# EAGLE design laminator (EAGLE 7.3.0)
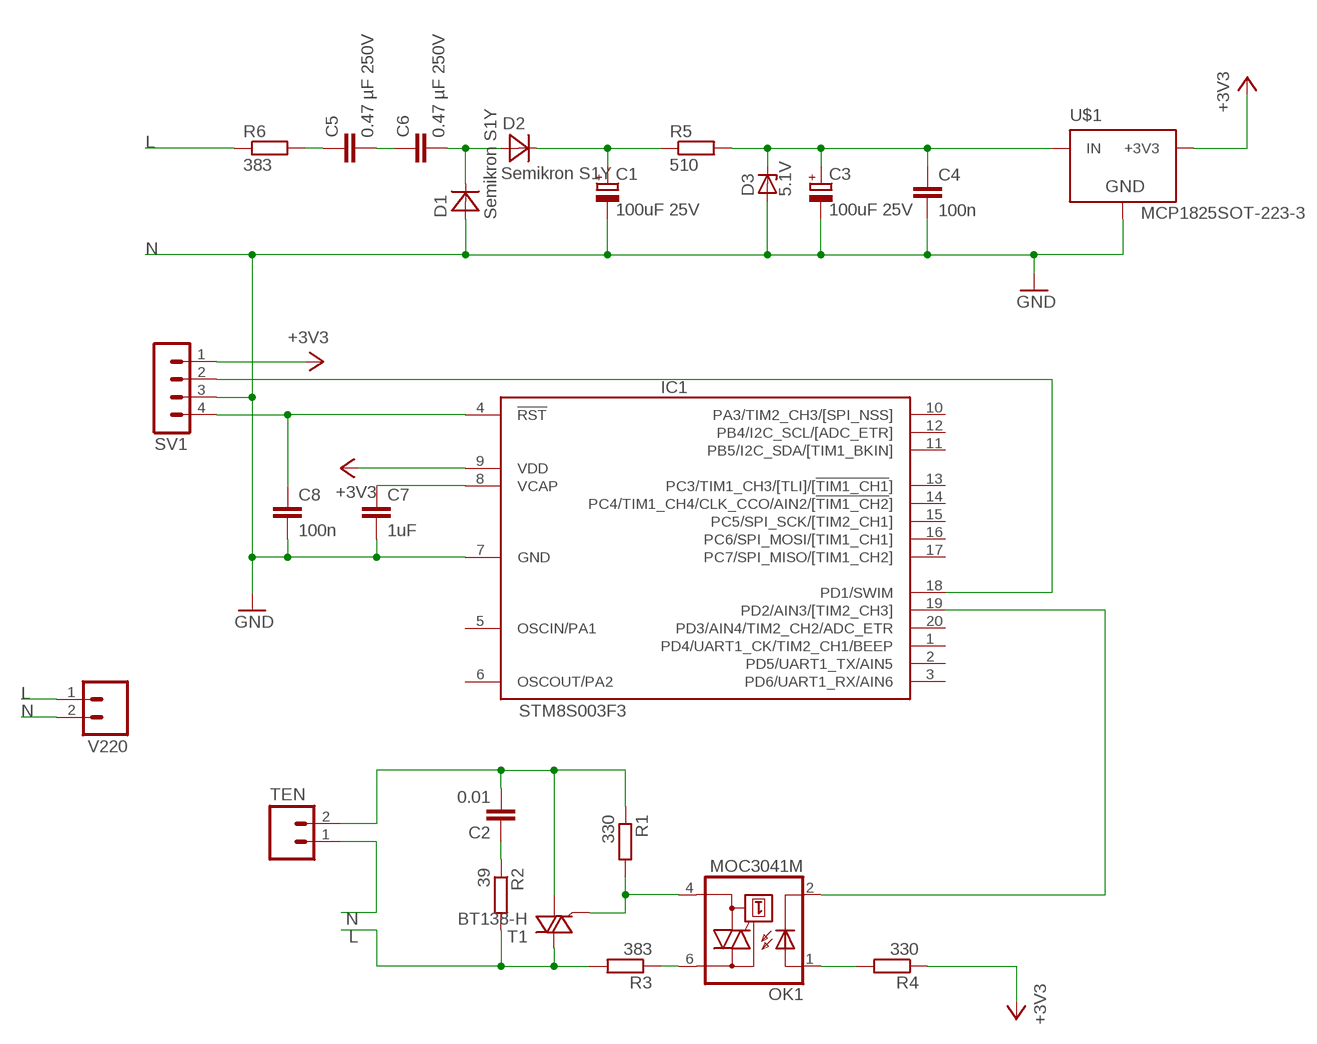
[diagram p0: schematic, sheet 1]

## Parts
C1  100uF 25V  CPOL-EUE2.5-6  [E2,5-6]
C2  0.01  C-EU050-025X075  [C050-025X075]
C3  100uF 25V  CPOL-EUE2.5-6  [E2,5-6]
C4  100n  C-EUC0805  [C0805]
C5  0.47 µF 250V  C-EU150-072X183  [C150-072X183]
C6  0.47 µF 250V  C-EU150-072X183  [C150-072X183]
C7  1uF  C-EUC0805  [C0805]
C8  100n  C-EUC0805  [C0805]
D1  Semikron S1Y  MBRA340T3  [SMA]
D2  Semikron S1Y  MBRA340T3  [SMA]
D3  5.1V  ZENER-DIODESMB  [SMB]
IC1  STM8S003F3  [TSSOP20]
OK1  MOC3041M  [DIL06]
R1  330  R-EU_0207/7  [0207/7]
R2  39  R-EU_0207/7  [0207/7]
R3  383  R-EU_0207/7  [0207/7]
R4  330  R-EU_R1206  [R1206]
R5  510  R-EU_R0805  [R0805]
R6  383  R-EU_0207/7  [0207/7]
SV1  MA04-1  [MA04-1]
T1  BT138-H  [TO220BH]
TEN  M02  [02P]
U$1  MCP1825SOT-223-3  [SOT-223]
V220  M02  [02P]

## Nets
+3V3: IC1.9(VDD) R4.1 SV1.1 U$1.3(+3V3)
L: R2.2 R3.2 R6.1 T1.T2(A2) V220.1
N: C1.- C3.- C4.2 C7.2 C8.2 D1.A D3.A IC1.7(GND) SV1.3 TEN.1 U$1.2(GND) V220.2 ; supply symbol labelled GND
N$1: OK1.6(A2) R3.1
N$2: C7.1 IC1.8(VCAP)
N$3: OK1.4(A1) R1.2 T1.G
N$4: C2.2 R1.1 T1.T1(A1) TEN.2
N$5: C6.2 D1.C D2.A
N$6: C2.1 R2.1
N$7: C8.1 IC1.4(!RST) SV1.4
N$8: OK1.1(A) R4.2
N$9: IC1.18(PD1/SWIM) SV1.2
N$10: IC1.19(PD2/AIN3/[TIM2_CH3]) OK1.2(C)
N$11: C1.+ D2.C R5.1
N$12: C3.+ C4.1 D3.C R5.2 U$1.1(IN)
N$14: C5.1 R6.2
N$15: C5.2 C6.1
Unconnected: IC1.1(PD4/UART1_CK/TIM2_CH1/BEEP) IC1.2(PD5/UART1_TX/AIN5) IC1.3(PD6/UART1_RX/AIN6) IC1.5(OSCIN/PA1) IC1.6(OSCOUT/PA2) IC1.10(PA3/TIM2_CH3/[SPI_NSS]) IC1.11(PB5/I2C_SDA/[TIM1_BKIN]) IC1.12(PB4/I2C_SCL/[ADC_ETR]) IC1.13(PC3/TIM1_CH3/[TLI]/[!TIM1_CH1!]) IC1.14(PC4/TIM1_CH4/CLK_CCO/AIN2/[!TIM1_CH2!]) IC1.15(PC5/SPI_SCK/[TIM2_CH1]) IC1.16(PC6/SPI_MOSI/[TIM1_CH1]) IC1.17(PC7/SPI_MISO/[TIM1_CH2]) IC1.20(PD3/AIN4/TIM2_CH2/ADC_ETR)

## Library data of the parts
C1 C3 = rcl:CPOL-EU: POLARIZED CAPACITOR, European symbol
C2 C4-C8 = rcl:C-EU: CAPACITOR, European symbol
D1 D2 = diode:MBRA340T3: Surface Mount Schottky Power Rectifier Source: http://www.onsemi.com/pub_link/Collateral/MBRA340T3-D.PDF
D3 = diode:ZENER-DIODE: Z-Diode
IC1 = stm8:STM8S003: Value line, 16 MHz STM8S 8-bit MCU, 8 Kbytes Flash, 128 bytes data EEPROM, 10-bit ADC, 3 timers, UART, SPI, I2C
OK1 = optocoupler:MOC30*: 6-Pin DIP Zero-Cross Optoisolators Triac Driver Output (250/400 Volt Peak) Source: Data sheet <http://www.fairchildsemi.com/ds/MO/MOC3031M.pdf> The old path of data sheet not more available 2013-05-06.; MF: FAIRCHILD SEMICONDUCTOR; MPN: MOC3041M; OC_FARNELL: 1086677; OC_NEWARK: 78K6090
R1-R6 = rcl:R-EU_: RESISTOR, European symbol
SV1 = con-lstb:MA04-1: PIN HEADER; OC_FARNELL: unknown; OC_NEWARK: unknown
T1 = triac:BT138: TRIAC Source: http://www.semiconductors.philips.com BT138_SERIES_2.pdf
TEN V220 = con-amp-quick:M02: AMP QUICK CONNECTOR; OC_FARNELL: unknown; OC_NEWARK: unknown
U$1 = SteelCaveRobotics-Power:MCP1825: MCP1825 3.3v LDO Linear Regulator

## Board
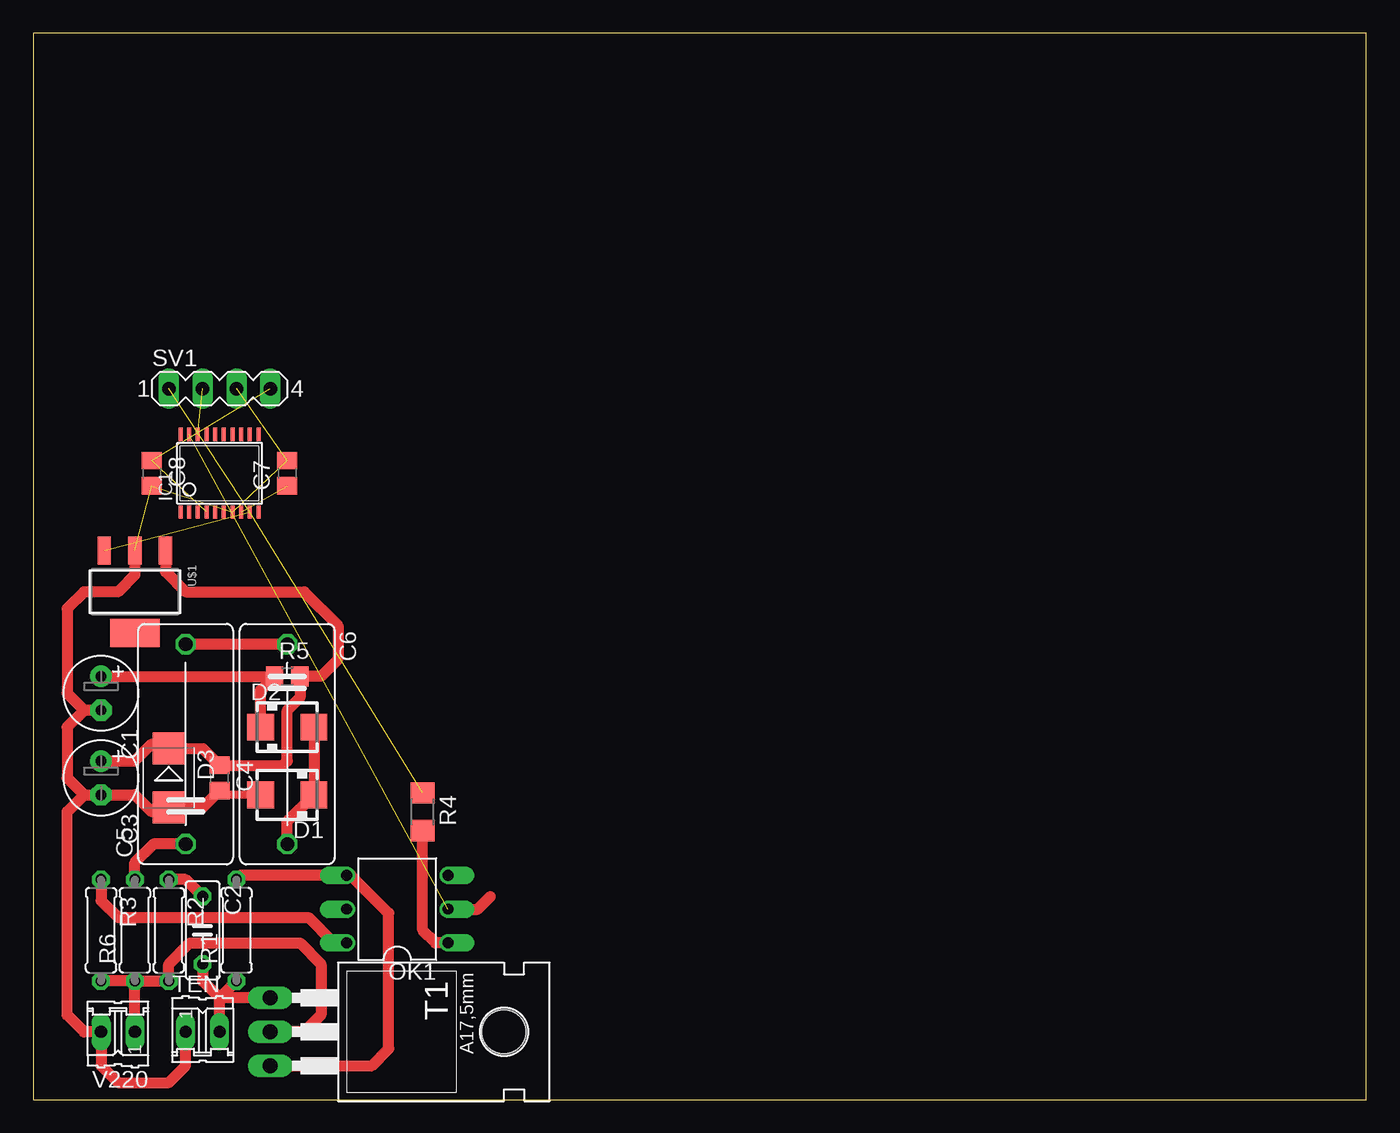
[diagram p1: board, top side]

Size 100 x 80 mm. Coordinates in mm from the lower left corner, seen from the top.
Outline: 0,0 100,0 100,80 0,80 0,0
Copper layers (1*16): Top 0.035mm / dielectric 1.5mm / Bottom 0.035mm
Design rules "default": minimum track width 10mil, minimum drill 24mil, track to track 8mil, track to pad 8mil, pad to pad 8mil, via to via 8mil, smd to smd 8mil, copper to edge 40mil, drill to drill 8mil, minimum pad ring 10mil, minimum via ring 8mil, stop-mask expansion 4mil, vias tented up to drill 0mil, thermal gap 10mil

### Footprints (pad centres in the part's own frame; a part is rotated, then mirrored left to right if it is on the bottom)
E2,5-6 = drill 0.813 pad 1.6: + -1.27,0 | drill 0.813 pad 1.6 octagon: - 1.27,0
C050-025X075 = drill 0.813 octagon: 1 -2.54,0; 2 2.54,0
C0805 = smd 1.3 x 1.5: 1 -0.95,0; 2 0.95,0
C150-072X183 = drill 1.016 octagon: 1 -7.493,0; 2 7.493,0
SMA = smd 2 x 2: A 2,0; C -2,0
SMB = smd 2.4 x 2.4: A 2.2,0; C -2.2,0
TSSOP20 = smd 0.305 x 0.991: 1 -2.925,-2.918; 2 -2.275,-2.918; 3 -1.625,-2.918; 4 -0.975,-2.918; 5 -0.325,-2.918; 6 0.325,-2.918; 7 0.975,-2.918; 8 1.625,-2.918; 9 2.275,-2.918; 10 2.925,-2.918; 11 2.925,2.918; 12 2.275,2.918; 13 1.625,2.918; 14 0.975,2.918; 15 0.325,2.918; 16 -0.325,2.918; 17 -0.975,2.918; 18 -1.625,2.918; 19 -2.275,2.918; 20 -2.925,2.918
DIL06 = drill 0.813 offset: 1 -2.54,-3.81; 2 0,-3.81; 3 2.54,-3.81; 4 2.54,3.81; 5 0,3.81; 6 -2.54,3.81
0207/7 = drill 0.813 octagon: 1 -3.81,0; 2 3.81,0
R1206 = smd 1.6 x 1.803: 1 -1.422,0; 2 1.422,0
R0805 = smd 1.3 x 1.5: 1 -0.95,0; 2 0.95,0
MA04-1 = drill 1.016 long: 1 -3.81,0; 2 -1.27,0; 3 1.27,0; 4 3.81,0
TO220BH = drill 1.118 long: G 2.54,-6.35; T1 -2.54,-6.35; T2 0,-6.35 | hole 3.302: 0,11.176
02P = drill 0.914 long: 1 -1.27,0; 2 1.27,0
SOT-223 = smd 1 x 2.1: 1 -2.3,-3.1; 2 0,-3.1; 3 2.3,-3.1 | smd 3.7 x 2.1: 4 0,3.1

### Placement (x,y rotation side)
C1  5.08,30.48 270 top
C2  12.7,12.7 270 top
C3  5.08,24.13 270 top
C4  13.97,24.13 270 top
C5  11.43,26.67 90 top
C6  19.05,26.67 270 top
C7  19.05,46.99 90 top
C8  8.89,46.99 270 top
D1  19.05,22.86 180 top
D2  19.05,27.94 0 top
D3  10.16,24.13 270 top
IC1  13.97,46.99 0 top
OK1  27.3,14.29 90 top
R1  15.24,12.7 90 top
R2  10.16,12.7 270 top
R3  5.08,12.7 270 top
R4  29.21,21.59 270 top
R5  19.05,31.75 0 top
R6  7.62,12.7 90 top
SV1  13.97,53.34 0 top
T1  24.13,5.08 270 top
TEN  12.7,5.08 0 top
U$1  7.62,38.1 180 top
V220  6.35,5.08 180 top

### Tracks (layer width: path | path; a pad name or v marks a point on that pad's centre or on a via)
+3V3  (3 unrouted)
L
  Top 0.813: V220.1 R6.1 | R6.1 R3.2 | R6.1 R2.2 10.16,10.16 11.75,11.75 20,11.75 21.59,10.16 21.59,6.35 20.32,5.08 T1.T2
N  (4 unrouted)
  Top 0.61: D1.A 14.29,22.86 C4.2
  Top 0.813: U$1.2 7.62,39.37 6.35,38.1 3.81,38.1 2.54,36.83 2.54,30.48 3.81,29.21 | C1.- 3.81,29.21 | 3.81,29.21 2.54,27.94 2.54,24.13 3.81,22.86 | 3.81,22.86 C3.- 7.62,22.86 8.89,21.59 9.23,21.93 D3.A 12.72,21.93 C4.2 | 3.81,22.86 2.54,21.59 2.54,6.35 3.81,5.08 V220.2 5.08,2.54 6.35,1.27 10.16,1.27 11.43,2.54 TEN.1
N$1
  Top 0.813: R3.1 5.08,14.92 6.35,13.65 20.64,13.65 22.54,11.75 OK1.6
N$2  (1 unrouted)
N$3
  Top 0.813: R1.2 15.56,16.83 OK1.4 23.81,16.83 26.67,13.97 26.67,3.81 25.4,2.54 T1.G
N$4
  Top 0.813: TEN.2 13.97,7.62 | 13.97,7.62 R1.1 | C2.2 12.7,8.89 13.97,7.62 | T1.T1 13.97,7.62
N$5
  Top 0.813: D2.A D1.C 19.05,20.86 C6.2
N$6
  Top 0.813: C2.1 11.43,16.51 R2.1
N$7  (2 unrouted)
N$8
  Top 0.813: OK1.1 30.16,11.75 29.21,12.7 R4.2
N$9  (1 unrouted)
N$10  (1 unrouted)
  Top 0.813: OK1.2 33.34,14.29 34.29,15.24
N$11
  Top 0.813: C1.+ R5.1 17.05,30.7 D2.C
N$12
  Top 0.813: U$1.1 9.92,39.61 11.43,38.1 20.32,38.1 22.86,35.56 22.86,33.02 21.59,31.75 R5.2 20,30.16 19.05,29.21 19.05,25.4 18.73,25.08 C4.1 12.72,26.33 D3.C 9.82,26.67 8.89,26.67 7.62,25.4 C3.+
N$14
  Top 0.813: R6.2 7.62,17.78 9.02,19.18 C5.1
N$15
  Top 0.813: C5.2 C6.1